# Altium project UcusKarti.PrjPcb (part 1 of 2)
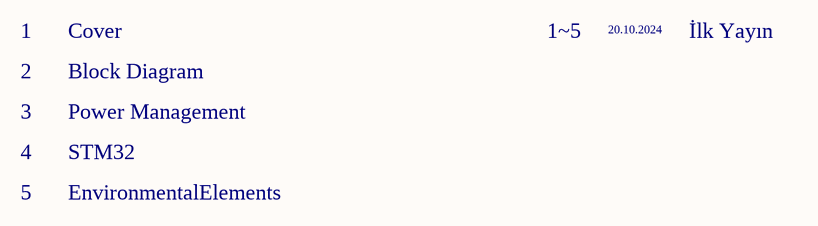
[diagram p0: Cover.SchDoc]
SheetSize: A3; ReleaseDate: 20.10.2024; ProjectDescription: Uçuş Kontrol Kartı; PreparedBy: Aslı Kurt
5 sheets, 52 parts. Net scope: global (net labels, ports and power ports of the same name join across sheets).
Board file: UcusKarti.PcbDoc
Sheets:
  Cover.SchDoc
  BlockDiagram.SchDoc
  PowerManagement.SchDoc
  STM32.SchDoc
  EnviromentalElements.SchDoc

## Sheet Cover.SchDoc
size A3; DocumentNumber: 1; SheetNumber: 1; SheetTotal: 5

### Notes on the sheet
- 1
- 2
- Cover
- Block Diagram
- 1~5
- 20.10.2024
- İlk Yayın
- 3
- Power Management
- 4
- 5
- STM32
- EnvironmentalElements
- İÇİNDEKİLER / CONTENTS
- REVİZYON / REVISION
- ÜRETİM NOTLARI / PRODUCTION NOTES
- Sayfa Nu.
- Page No
- Açıklama / Description
- Tarih
- Date
- Board Features
- Kart Özellikleri
- Üretim Çıktıları
- Gerber Files
- Ekler
- Attachments
- İLETİŞİM / CONTACT
- DOSYA ADI / FILE NAME
- TANIM / DESCRIPTION
- HAZIRLAYAN / PREPARED BY
- YAYIN TARİHİ / REL. DATE
- BOYUT / SIZE
- SAYFA / SHEET
- /

## Sheet BlockDiagram.SchDoc
size A3; DocumentNumber: 2; SheetNumber: 2; SheetTotal: 5; ProjectDescription: Uçuş Kontrol Kartı
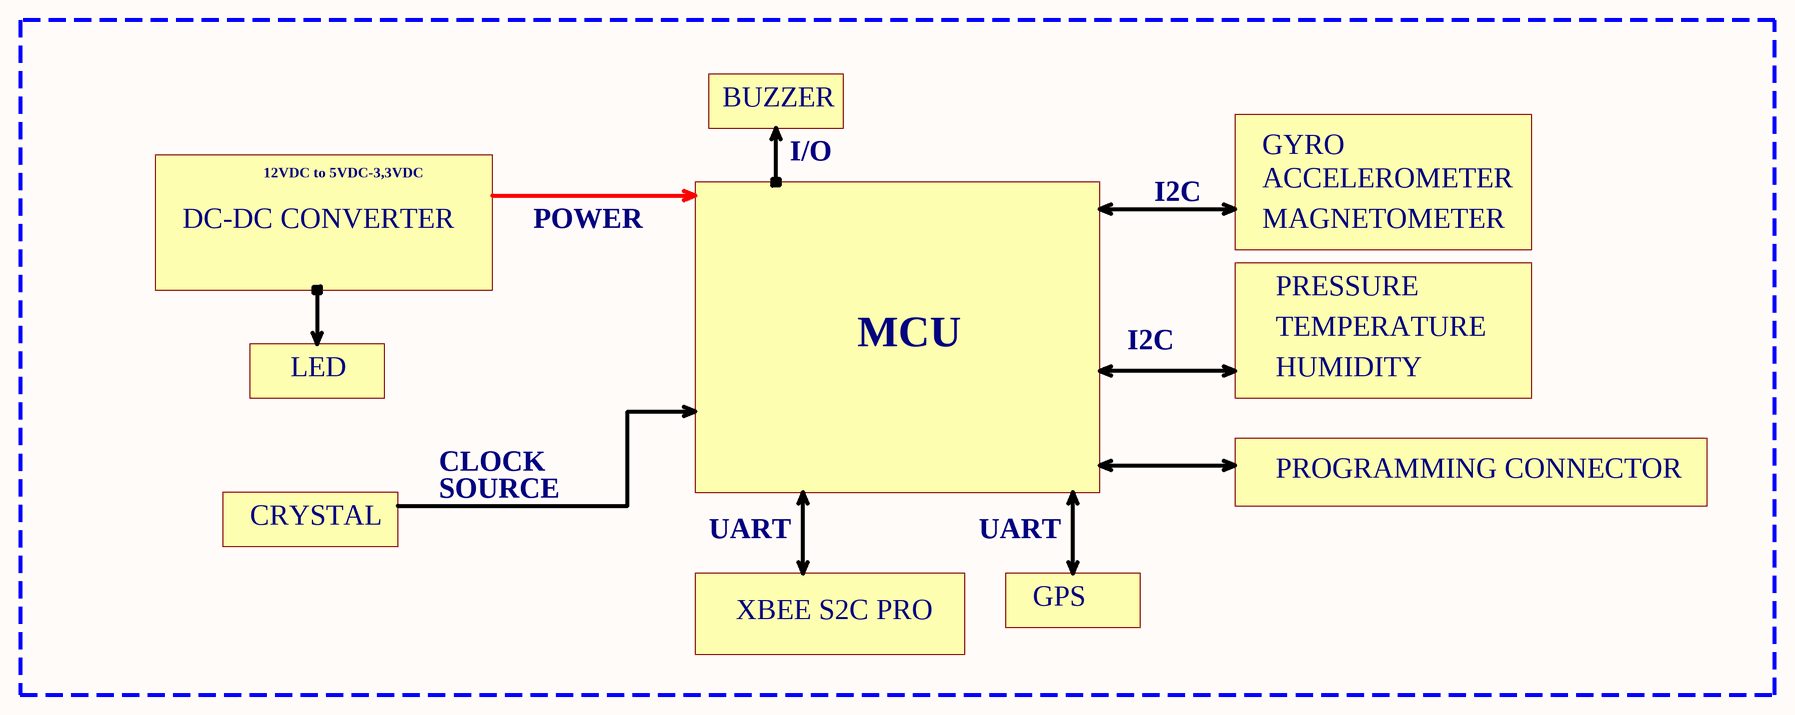
[diagram p1: BlockDiagram.SchDoc]

### Notes on the sheet
- BUZZER
- 12VDC to 5VDC-3,3VDC
- I/O
- GYRO
- DC-DC CONVERTER
- POWER
- I2C
- ACCELEROMETER
- MAGNETOMETER
- PRESSURE
- LED
- MCU
- TEMPERATURE
- HUMIDITY
- CLOCK
- SOURCE
- PROGRAMMING CONNECTOR
- CRYSTAL
- UART
- XBEE S2C PRO
- GPS
- DOSYA ADI / FILE NAME
- TANIM / DESCRIPTION
- HAZIRLAYAN / PREPARED BY
- YAYIN TARİHİ / REL. DATE
- BOYUT / SIZE
- SAYFA / SHEET
- /

## Sheet PowerManagement.SchDoc
size A3; DocumentNumber: 3; SheetNumber: 3; SheetTotal: 5; PreparedBy: Aslı Kurt
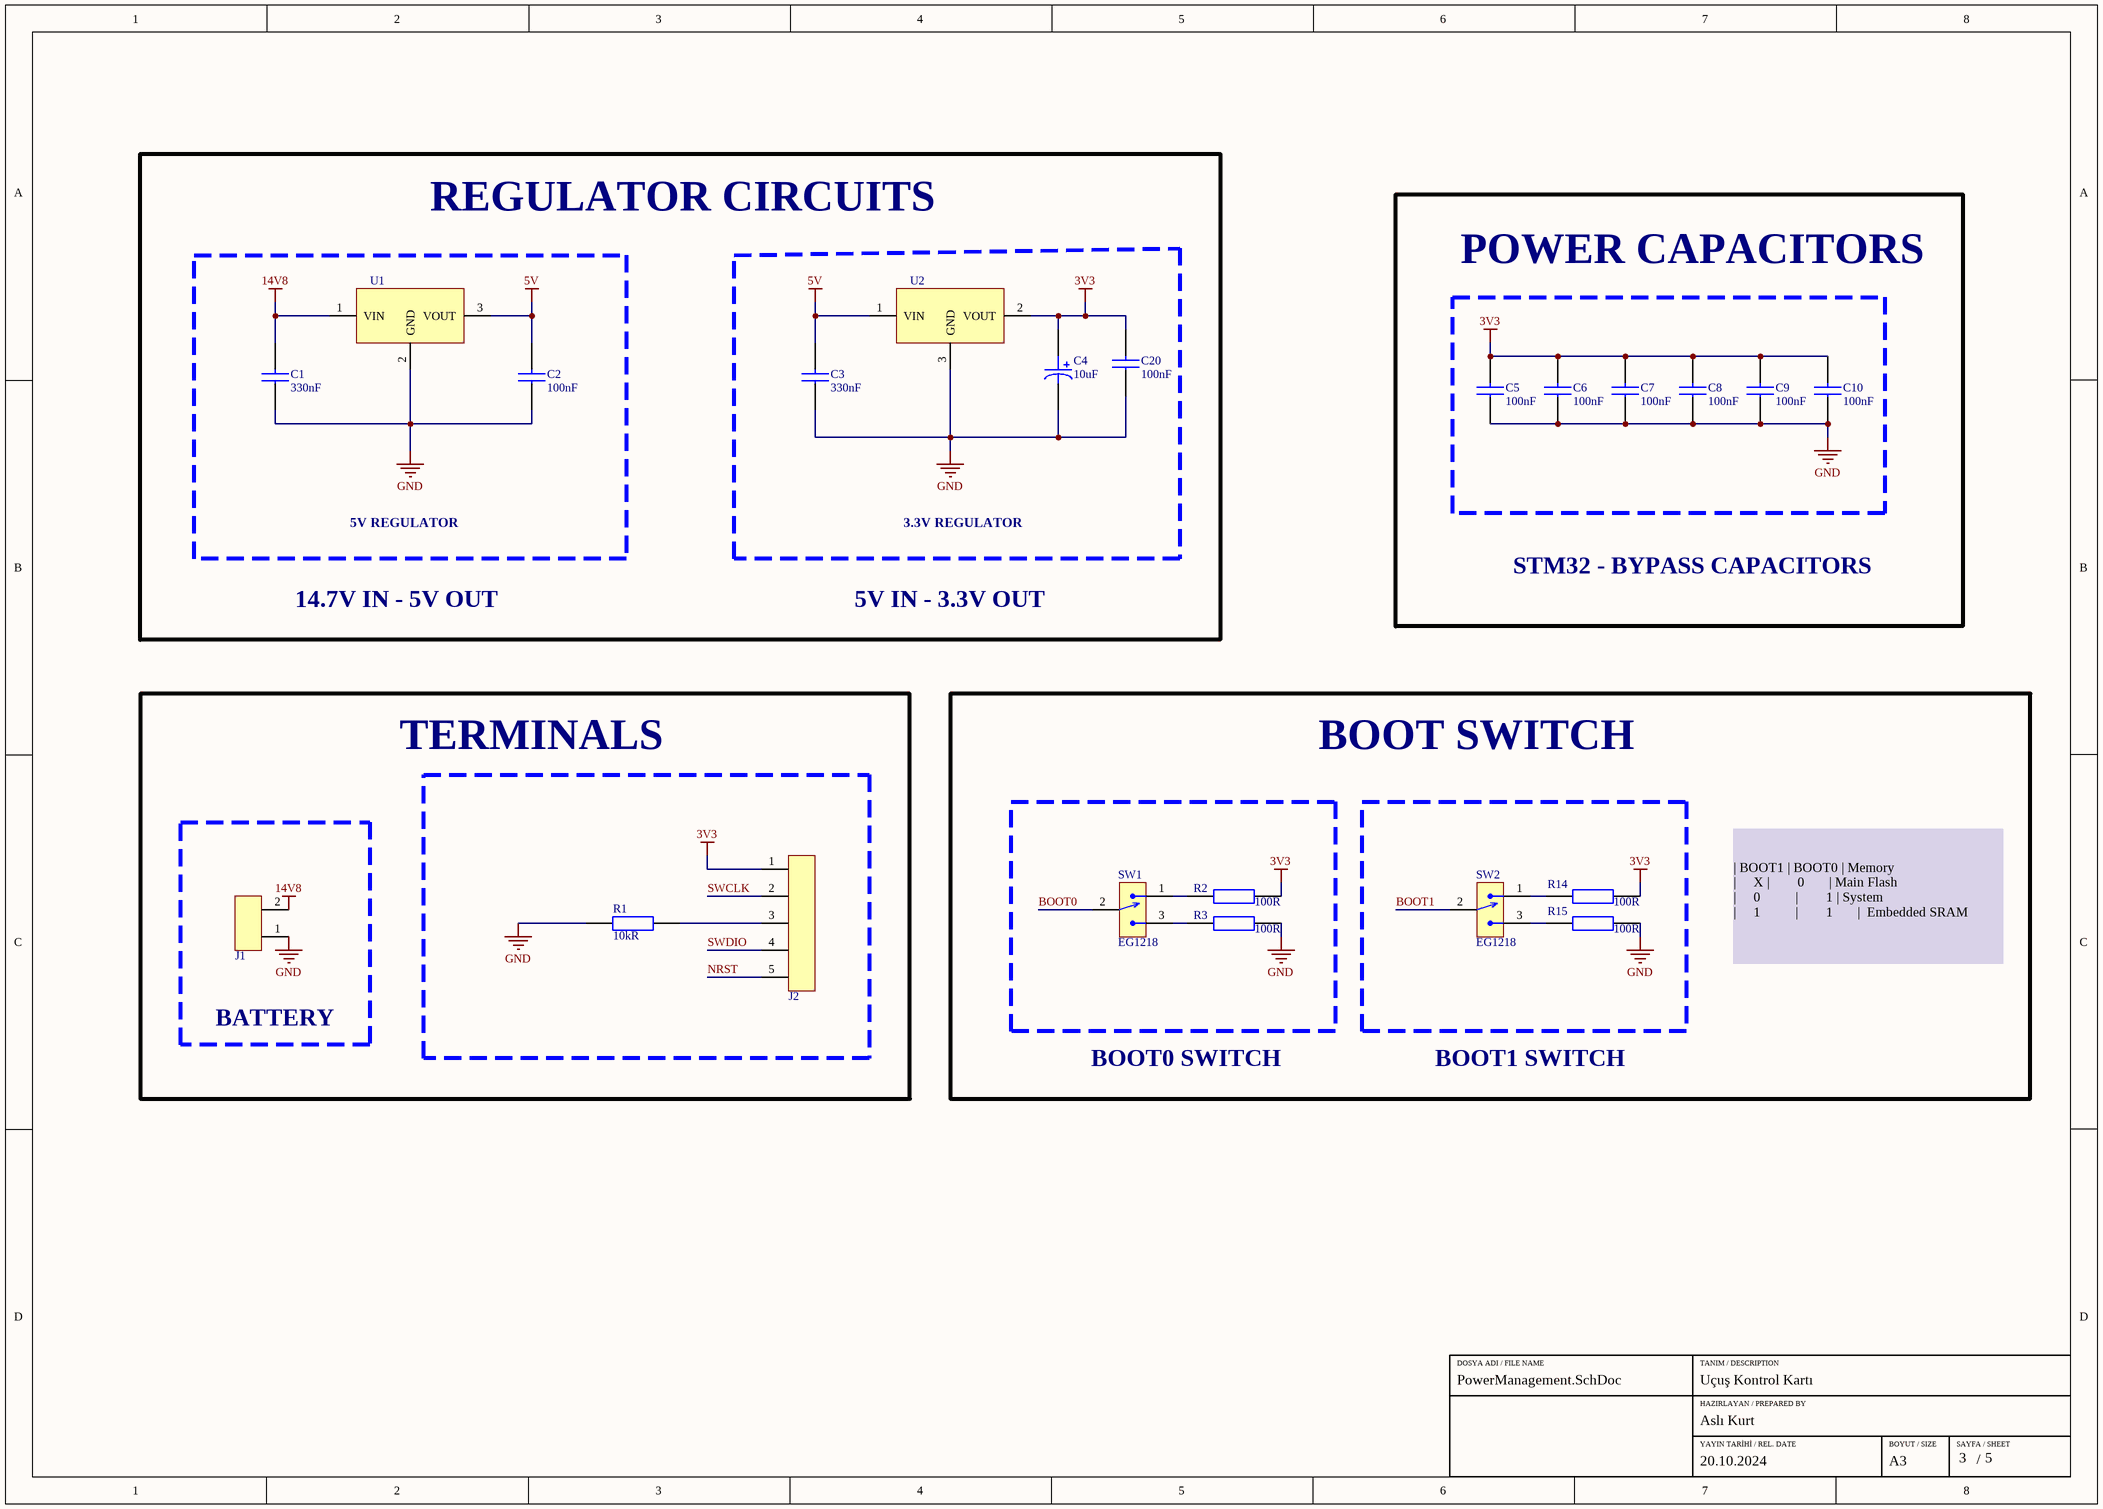
[diagram p2: PowerManagement.SchDoc]

### Parts
C1  Capacitance: 330nF  [CAP_0603]  (hidden comment: CGA3E3X7R1H334K080AB)
C2  Capacitance: 100nF  [CAP_0603]  (hidden comment: C0603C104K5RACTU)
C3  Capacitance: 330nF  [CAP_0603]  (hidden comment: CGA3E3X7R1H334K080AB)
C4  Capacitance: 10uF  [CAP_RADIAL_D5_P5.5_SMD]  (hidden comment: 865080642006)
C5  Capacitance: 100nF  [CAP_0603]  (hidden comment: C0603C104K5RACTU)
C6  Capacitance: 100nF  [CAP_0603]  (hidden comment: C0603C104K5RACTU)
C7  Capacitance: 100nF  [CAP_0603]  (hidden comment: C0603C104K5RACTU)
C8  Capacitance: 100nF  [CAP_0603]  (hidden comment: C0603C104K5RACTU)
C9  Capacitance: 100nF  [CAP_0603]  (hidden comment: C0603C104K5RACTU)
C10  Capacitance: 100nF  [CAP_0603]  (hidden comment: C0603C104K5RACTU)
C20  Capacitance: 100nF  [CAP_0603]  (hidden comment: C0603C104K5RACTU)
J1  282836-2  [TERMINAL]  (value not drawn)
J2  61300511121  [5x1 Male Header 2.54mm]  (value not drawn)
R1  Resistance: 10kR  [RES_0805]  (hidden comment: RC0805JR-0710KL)
R2  Resistance: 100R  [RES_0603]  (hidden comment: RC0603JR-07100RL)
R3  Resistance: 100R  [RES_0603]  (hidden comment: RC0603JR-07100RL)
R14  Resistance: 100R  [RES_0603]  (hidden comment: RC0603JR-07100RL)
R15  Resistance: 100R  [RES_0603]  (hidden comment: RC0603JR-07100RL)
SW1  EG1218  [SWITCHSLIDE_1POS_DIP]
SW2  EG1218  [SWITCHSLIDE_1POS_DIP]
U1  L7805CD2T-TR  [D2PAK-TO-263-3]  (value not drawn)
U2  LD29150DT33R  [DPAK-TO252]  (value not drawn)

### Blocks framed on the sheet
POWER CAPACITORS: C5-C10
5V REGULATOR: C1 C2 U1
3.3V REGULATOR: C3 C4 C20 U2
TERMINALS: J2 R1
BOOT SWITCH: R2 R3 R14 R15 SW1 SW2
BATTERY: J1

### Nets
3V3: C4.1 C5.2 C6.2 C7.2 C8.2 C9.2 C10.2 C20.2 J2.1 R2.2 R14.2 U2.2(VOUT)
5V: C2.2 C3.2 U1.3(VOUT) U2.1(VIN)
14V8: C1.2 J1.2 U1.1(VIN)
GND: C1.1 C2.1 C3.1 C4.2 C5.1 C6.1 C7.1 C8.1 C9.1 C10.1 C20.1 J1.1 R1.1 R3.2 R15.2 U1.2(GND) U2.3(GND)
BOOT0: SW1.2
BOOT1: SW2.2
NRST: J2.5
SWCLK: J2.2
SWDIO: J2.4
NetJ2_3: J2.3 R1.2
NetR2_1: R2.1 SW1.1
NetR3_1: R3.1 SW1.3
NetR14_1: R14.1 SW2.1
NetR15_1: R15.1 SW2.3

### Notes on the sheet
- REGULATOR CIRCUITS
- STM32 - BYPASS CAPACITORS
- 14.7V IN - 5V OUT
- 5V IN - 3.3V OUT
- | BOOT1	| BOOT0	| Memory
  |     X	|        0       | Main Flash
  |     0          |        1	| System
  |     1          |        1       |  Embedded SRAM
- BOOT0 SWITCH
- BOOT1 SWITCH
- DOSYA ADI / FILE NAME
- TANIM / DESCRIPTION
- HAZIRLAYAN / PREPARED BY
- YAYIN TARİHİ / REL. DATE
- BOYUT / SIZE
- SAYFA / SHEET
- /

### Library data of the parts
C1 C3 = CAP CER 330nF 0603: Multilayer Ceramic Capacitor, 0.33 uF, 50 V, ± 10%, X7R, 0603 [1608 Metric]; Manufacturer: TDK; DesignedBy: Aslı Kurt; Material: 4241ConductorMaterial; Voltage Rating: 50V; Supplier 1: Rs; Manufacturer Part Number: CGA3E3X7R1H334K080AB; RoHS: Yes; Category: Ceramic Capacitors; Stock 1: 1350; Pricing 1: 50=0,082, 250=0,066, 500=0,058, 1000=0,049 (GBP); Mount: Surface Mount; Case/Package: 0603; Case Code (Metric): 1608; Case Code (Imperial): 0603; Weight: 7.1E-05oz; Min Operating Temperature: -55°C; Max Operating Temperature: 125°C; Packaging: Tape and Reel; Tolerance: 10%; Dielectric: X7R; Termination: SMD/SMT; Voltage Rating (DC): 50V; Package Quantity: 4000; Series: CGA; Length: 0.063inch; Width: 0.031inch; Height: 0.8mm; Thickness: 0.035inch; Ratings: AEC-Q200; RoHS Compliant: Yes; ComponentLink1URL: http://www.mouser.com/ds/2/400/lcc_automotive_general_en-843974.pdf?src-supplier=Mouser; ComponentLink1Description: http://www.mouser.com/ds/2/400/lcc_automotive_general_en-843974.pdf?src-supplier=Mouser; ComponentLink2URL: https://datasheet.octopart.com/CGA3E3X7R1H334K080AB-TDK-datasheet-43366117.pdf?src-supplier=Future+Electronics; ComponentLink2Description: https://datasheet.octopart.com/CGA3E3X7R1H334K080AB-TDK-datasheet-43366117.pdf?src-supplier=Future+Electronics; ComponentLink3URL: https://product.tdk.com/info/en/documents/chara_sheet/CGA3E3X7R1H334K080AB.pdf?src-supplier=Digikey; ComponentLink3Description: https://product.tdk.com/info/en/documents/chara_sheet/CGA3E3X7R1H334K080AB.pdf?src-supplier=Digikey; ComponentLink4URL: https://product.tdk.com/info/en/catalog/datasheets/mlcc_automotive_general_en.pdf?src-supplier=Digikey; ComponentLink4Description: https://product.tdk.com/info/en/catalog/datasheets/mlcc_automotive_general_en.pdf?src-supplier=Digikey; ComponentLink5URL: http://product.tdk.com/capacitor/mlcc/class/print_detail_pdf.php?lang=en&part_no=CGA3E3X7R1H334K080AB&src-supplier=Avnet; ComponentLink5Description: http://product.tdk.com/capacitor/mlcc/class/print_detail_pdf.php?lang=en&part_no=CGA3E3X7R1H334K080AB&src-supplier=Avnet; ComponentLink6URL: https://datasheet.octopart.com/CGA3E3X7R1H334K080AB-TDK-datasheet-165583812.pdf?src-supplier=TME; ComponentLink6Description: https://datasheet.octopart.com/CGA3E3X7R1H334K080AB-TDK-datasheet-165583812.pdf?src-supplier=TME; Supplier 2: Avnet; Stock 2: 26394; Pricing 2: 1=0,231, 10=0,105, 25=0,093, 50=0,08, 100=0,068 (USD); Supplier 3: Farnell; Stock 3: 76750; Pricing 3: 10=0,156, 100=0,0848, 500=0,0677, 1000=0,0505, 2000=0,0453, 4000=0,04, 20000=0,0371, 40000=0,0362 (EUR); Supplier 4: Mouser; Stock 4: 154875; Pricing 4: 1=0,23, 10=0,098, 50=0,098, 100=0,063, 1000=0,053, 10000=0,032 (USD); Supplier 5: Digikey; Stock 5: 1242048; Pricing 5: 1=0,24, 10=0,139, 50=0,0982, 100=0,0858, 500=0,06458, 1000=0,05797 (USD); Supplier Part Number 1: 2427476; Supplier Part Number 2: 71AH2809; Supplier Part Number 3: 3416368; Supplier Part Number 4: 810-CGA3E3X7R1H334KB; Supplier Part Number 5: 445-174426-1-ND
C2 C5-C10 C20 = CAP CER 100nF 0603: CAP CER 100nF %10 0603 SMD; Manufacturer: KEMET; DesignedBy: Aslı Kurt; Dielectric Material: Ceramic; Voltage Rating (DC): 50V; Tolerance: 10%; Dielectric: X7R; Dissipation Factor: 2.5%; Supplier 1: Digi-Key; Manufacturer Part Number: C0603C104K5RACTU; RoHS: Yes; Category: Ceramic Capacitors; Stock 1: 1666186; Pricing 1: 1=0,12000, 10=0,08500, 50=0,04620, 100=0,03770, 500=0,02696, 1000=0,02118 (USD); Mount: Surface Mount; Case/Package: 0603; Number of Pins: 2; Case Code (Metric): 1608; Case Code (Imperial): 0603; Contact Plating: Tin,Matte; Min Operating Temperature: -55°C; Max Operating Temperature: 125°C; Packaging: Tape and Reel; Package Quantity: 1; Termination: SMD/SMT; Voltage: 50V; Voltage Rating: 50V; Series: SMD Comm X7R; Length: 0.063inch; Width: 0.031inch; Height: 0.8mm; Thickness: 0.034inch; Lead Pitch: 0.7mm; Depth: 0.8mm; Radiation Hardening: No; RoHS Compliant: Yes; REACH SVHC: No SVHC; ComponentLink1URL: https://datasheet.ciiva.com/7823/kem-c1002-x7r-smd-7823591.pdf?src-supplier=Element14; ComponentLink1Description: https://datasheet.ciiva.com/7823/kem-c1002-x7r-smd-7823591.pdf?src-supplier=Element14; ComponentLink2URL: https://datasheet.ciiva.com/14602/70095383-14602583.pdf?src-supplier=Allied+Electronics; ComponentLink2Description: https://datasheet.ciiva.com/14602/70095383-14602583.pdf?src-supplier=Allied+Electronics; ComponentLink3URL: https://datasheet.ciiva.com/5999/kem-c1002-x7r-smd-5999400.pdf?src-supplier=Farnell; ComponentLink3Description: https://datasheet.ciiva.com/5999/kem-c1002-x7r-smd-5999400.pdf?src-supplier=Farnell; ComponentLink4URL: https://datasheet.ciiva.com/7823/kem-c1002-x7r-smd-7823592.pdf?src-supplier=Element14; ComponentLink4Description: https://datasheet.ciiva.com/7823/kem-c1002-x7r-smd-7823592.pdf?src-supplier=Element14; ComponentLink5URL: https://datasheet.ciiva.com/28645/1851736-28645640.pdf?src-supplier=Element14; ComponentLink5Description: https://datasheet.ciiva.com/28645/1851736-28645640.pdf?src-supplier=Element14; ComponentLink6URL: https://datasheet.ciiva.com/14585/70095383-14585209.pdf?src-supplier=Allied+Electronics; ComponentLink6Description: https://datasheet.ciiva.com/14585/70095383-14585209.pdf?src-supplier=Allied+Electronics; Supplier Part Number 1: 399-5089-1-ND
C4 = CAP ALU ELEC 10uF  50V: CAP ALUM 10UF 20% 50V SMD; Manufacturer: Wurth Electronics; Ripple Current: 95mA; Impedance: 2.8R; ESR (Equivalent Series Resistance): 1.63932R; Insulation Resistance: 10MR; Leakage Current: 5uA; DesignedBy: Aslı Kurt; Supplier 1: Rs; Manufacturer Part Number: 865080642006; RoHS: Yes; Category: Aluminum Electrolytic Capacitors; Stock 1: 250; Pricing 1: 25=0,16 (GBP); Mount: Surface Mount; Case/Package: Radial; Min Operating Temperature: -55°C; Max Operating Temperature: 105°C; Package Quantity: 1; Packaging: Cut Tape; Voltage Rating: 50V; Ripple Current (AC): 95mA; Tolerance: 20%; Voltage Rating (DC): 50V; Series: WCAP-ASLI; Diameter: 5mm; Length: 5.5mm; Width: 5.3mm; Height: 5.5mm; Height - Seated (Max): 0.217inch; RoHS Compliant: Yes; Reach SVHC Compliant: Unknown; ComponentLink1URL: http://www.farnell.com/datasheets/1880176.pdf?src-supplier=Farnell; ComponentLink1Description: http://www.farnell.com/datasheets/1880176.pdf?src-supplier=Farnell; ComponentLink2URL: http://www.farnell.com/datasheets/1880176.pdf?src-supplier=Element14; ComponentLink2Description: http://www.farnell.com/datasheets/1880176.pdf?src-supplier=Element14; ComponentLink3URL: http://www.farnell.com/datasheets/1880176.pdf?src-supplier=Newark; ComponentLink3Description: http://www.farnell.com/datasheets/1880176.pdf?src-supplier=Newark; ComponentLink4URL: http://katalog.we-online.de/pbs/datasheet/865080642006.pdf?src-supplier=Digikey; ComponentLink4Description: http://katalog.we-online.de/pbs/datasheet/865080642006.pdf?src-supplier=Digikey; ComponentLink5URL: https://katalog.we-online.de/pbs/datasheet/865080642006.pdf?src-supplier=Digikey; ComponentLink5Description: https://katalog.we-online.de/pbs/datasheet/865080642006.pdf?src-supplier=Digikey; Supplier 2: Farnell; Stock 2: 875; Pricing 2: 1=0,27, 50=0,165, 100=0,154, 250=0,128, 500=0,112, 1000=0,108, 5000=0,107, 10000=0,105 (EUR); Supplier 3: Mouser; Stock 3: 13568; Pricing 3: 1=0,2, 10=0,2, 50=0,174, 100=0,151, 1000=0,112, 10000=0,112 (USD); Supplier 4: Digikey; Stock 4: 72984; Pricing 4: 1=0,2, 50=0,174, 100=0,151, 250=0,134, 500=0,118 (USD); Supplier Part Number 4: 732-8451-1-ND; Supplier Part Number 3: 710-865080642006; Supplier Part Number 2: 2466333; Supplier Part Number 1: 8391862
J1 = 2x1 TERMINAL 5mm: Connector, Terminal Block; Wire Receptacle; 2 Pos.; 16-30 AWG; 0.197 in. CL; Sid; Manufacturer: TE Connectivity; DesignedBy: Aslı Kurt; Plating: Brass; Number of Positions: 2; Number of Levels: 1; Current: 13.5A; Voltage: 300V; Interlock: Yes (With); Screw Flange: No (Without); Connector System: 5937ConnectorSystem; Voltage Rating (DC): 250V; Pitch: 5mm; Wire Gauge (Max): 30AWG; Thread Size: M3; Tail Length: 3.5mm; Approvals: UL; Supplier 1: Digikey; Manufacturer Part Number: 282836-2; RoHS: Yes; Category: Terminal Blocks; Stock 1: 33835; Pricing 1: 1=0,6, 10=0,578, 25=0,576, 50=0,5566, 100=0,4666, 300=0,43743, 600=0,41315, 1200=0,36211, 5100=0,31593 (USD); Mount: Through Hole; Color: Green; Contact Material: Brass; Housing Color: Green; Contact Plating: Tin; Housing Material: Polyamide; Insulation Material: Nylon; Min Operating Temperature: -40°C; Max Operating Temperature: 105°C; Number of Rows: 1; Termination: Solder; Series: Buchanan; Packaging: Tray; Package Quantity: 300; Number of Positions Per Level: 2; Number of Contacts: 2; Orientation: Straight; Current Rating: 13.5A; Number of Circuits: 2; Screwless Terminal Block: No (Without); Side Stackable: Yes (With); Operating Supply Voltage: 300V; Voltage Rating: 300V; Max Voltage Rating (AC): 300V; Number of Poles: 2; Max Supply Voltage (AC): 300V; Connector Type: Receptacle; Closed End: No (Without); Max Current Rating: 13.5A; Length: 10.6mm; Width: 10mm; Wire Gauge (Min): 30AWG; Wire/Cable Gauge: 30AWG; Depth: 8.2mm; Radiation Hardening: No; Flammability Rating: UL94 V-0; RoHS Compliant: Yes; ELV: Compliant; Lead Free: Lead Free; Reach SVHC Compliant: Unknown; ComponentLink1URL: https://datasheet.ciiva.com/7628/1731782-7628513.pdf?src-supplier=Element14; ComponentLink1Description: https://datasheet.ciiva.com/7628/1731782-7628513.pdf?src-supplier=Element14; ComponentLink2URL: https://datasheet.ciiva.com/16393/282836-2-16393382.pdf?src-supplier=Future+Electronics; ComponentLink2Description: https://datasheet.ciiva.com/16393/282836-2-16393382.pdf?src-supplier=Future+Electronics; ComponentLink3URL: https://datasheet.ciiva.com/15169/getdatasheetpartid-155855-15169553.pdf?src-supplier=Verical; ComponentLink3Description: https://datasheet.ciiva.com/15169/getdatasheetpartid-155855-15169553.pdf?src-supplier=Verical; ComponentLink4URL: https://datasheet.ciiva.com/11757/0900766b8002dc8a-11757385.pdf?src-supplier=Rs; ComponentLink4Description: https://datasheet.ciiva.com/11757/0900766b8002dc8a-11757385.pdf?src-supplier=Rs; ComponentLink5URL: https://datasheet.ciiva.com/823/eng-cd-282836-h10-823437.pdf?src-supplier=Digikey; ComponentLink5Description: https://datasheet.ciiva.com/823/eng-cd-282836-h10-823437.pdf?src-supplier=Digikey; ComponentLink6URL: https://datasheet.ciiva.com/3141/eng-cs-1308389-eurostyle-terminal-blocks-0607-3141118.pdf?src-supplier=Avnet; ComponentLink6Description: https://datasheet.ciiva.com/3141/eng-cs-1308389-eurostyle-terminal-blocks-0607-3141118.pdf?src-supplier=Avnet; ComponentLink7URL: https://datasheet.ciiva.com/30261/eng-cs-1308389-eurostyle-terminal-blocks-0607-30261813.pdf?src-supplier=Onlinecomponents.com; ComponentLink7Description: https://datasheet.ciiva.com/30261/eng-cs-1308389-eurostyle-terminal-blocks-0607-30261813.pdf?src-supplier=Onlinecomponents.com; Supplier Part Number 1: A98076-ND
J2 = 5x1 Male Header 2.54mm: DesignedBy: Aslı Kurt
R1 = RES 10K OHM 0805: RES 10K OHM 5% 1/8W 0805; Manufacturer: Yageo; DesignedBy: Aslı Kurt; Power Rating: 125mW; Temperature Coefficient: 100ppm/°C; Voltage Rating: 150V; Supplier 1: Digikey; Manufacturer Part Number: RC0805JR-0710KL; RoHS: Yes; Category: Chip SMD Resistors; Stock 1: 444162; Pricing 1: 1=0,1, 10=0,023, 50=0,0144, 100=0,012, 500=0,00818, 1000=0,00706 (USD); Case/Package: 0805; Contact Plating: Tin,Matte; Case Code (Imperial): 0805; Case Code (Metric): 2012; Size Code: 0805; Min Operating Temperature: -55°C; Max Operating Temperature: 155°C; Resistor Type: Thick Film; Tolerance: 5%; Packaging: Tape and Reel; Termination: SMD/SMT; Features: Moisture Resistant; Series: RC; Max Power Dissipation: 125mW; Number of Terminations: 2; Resistance Tolerance: 5%; Construction: Rectangular; Length: 2mm; Width: 1.25mm; Height: 0.5mm; Depth: 1.25mm; Radiation Hardening: No; RoHS Compliant: Yes; Military Standard: Not; Reach SVHC Compliant: Unknown; Lead Free: 5697LeadFree; ComponentLink1URL: https://datasheet.ciiva.com/7983/444164-7983765.pdf?src-supplier=Element14; ComponentLink1Description: https://datasheet.ciiva.com/7983/444164-7983765.pdf?src-supplier=Element14; ComponentLink2URL: https://datasheet.ciiva.com/7941/444164-7941870.pdf?src-supplier=Element14; ComponentLink2Description: https://datasheet.ciiva.com/7941/444164-7941870.pdf?src-supplier=Element14; ComponentLink3URL: https://datasheet.ciiva.com/7941/444164-7941871.pdf?src-supplier=Element14; ComponentLink3Description: https://datasheet.ciiva.com/7941/444164-7941871.pdf?src-supplier=Element14; Supplier Part Number 1: 311-10KARCT-ND
R2 R3 R14 R15 = RES 100 OHM 0603: RES 100 %5 OHM 0603 SMD; Manufacturer: Yageo; DesignedBy: Aslı Kurt; Tolerance: 5%; Temperature Coefficient: 100ppm/°C; Voltage Rating (DC): 50V; Power Rating: 100mW; Supplier 1: Digi-Key; Manufacturer Part Number: RC0603JR-07100RL; RoHS: Yes; Category: Chip SMD Resistors; Stock 1: 4334796; Pricing 1: 1=0,10000, 10=0,01900, 100=0,00770, 1000=0,00344, 2500=0,00298 (USD); Case/Package: 0603; Number of Pins: 2; Contact Plating: Tin,Matte; Case Code (Imperial): 0603; Case Code (Metric): 1608; Size Code: 0603; Min Operating Temperature: -55°C; Max Operating Temperature: 155°C; Resistor Type: Thick Film; Packaging: Tape and Reel; Voltage Rating: 50V; Termination: SMD/SMT; Features: Moisture Resistant; Series: RC; Max Power Dissipation: 100mW; Number of Terminations: 2; Construction: Rectangular; Resistance Tolerance: 5%; Length: 1.6mm; Width: 0.8mm; Depth: 0.8mm; Radiation Hardening: No; REACH SVHC: Unknown; Lead Free: Lead Free; Military Standard: Not; RoHS Compliant: Yes; ComponentLink1URL: https://datasheet.ciiva.com/15189/getdatasheetpartid-325207-15189846.pdf?src-supplier=Verical; ComponentLink1Description: https://datasheet.ciiva.com/15189/getdatasheetpartid-325207-15189846.pdf?src-supplier=Verical; ComponentLink2URL: https://datasheet.ciiva.com/8883/pyu-rc0603-51-rohs-l-4-8883047.pdf?src-supplier=Avnet; ComponentLink2Description: https://datasheet.ciiva.com/8883/pyu-rc0603-51-rohs-l-4-8883047.pdf?src-supplier=Avnet; ComponentLink3URL: https://datasheet.ciiva.com/7746/443971-7746425.pdf?src-supplier=Element14; ComponentLink3Description: https://datasheet.ciiva.com/7746/443971-7746425.pdf?src-supplier=Element14; ComponentLink4URL: https://datasheet.ciiva.com/7746/443971-7746426.pdf?src-supplier=Element14; ComponentLink4Description: https://datasheet.ciiva.com/7746/443971-7746426.pdf?src-supplier=Element14; Supplier Part Number 1: 311-100GRCT-ND
SW1 SW2 = EG1218: Slide Switch, SPDT, ON-ON, 200 mA, 30V DC, TH, PC Pin, EG Series | E-Switch EG1218; Contact Current Rating: 200mA; Operating Force: 250gf; Illumination Type: Non-Illuminated; Electrical Life: 10000Cycles; Number of Positions: 2; Switch Travel: 2.5mm; Insulation Resistance: 100R; Contact Resistance: 20mR; Actuator Type: Standard; Dropout Voltage: 300mV; Max Output Current: 150mA; Min Input Voltage: 4.3V; Nominal Output Voltage: 3.3V; Power Rating: 250mW; Actuator Length: 2mm; DesignedBy: Aslı Kurt; Supplier 1: Future Electronics; Manufacturer: E-Switch; Manufacturer Part Number: EG1218; RoHS: Yes; Category: Slide Switches; Stock 1: 30199; Pricing 1: 1=0,43, 100=0,41, 200=0,4, 300=0,435, 500=0,385, 1000=0,42, 1250=0,36, 3000=0,39 (USD); Mount: Through Hole; Case/Package: 947Case; Number of Pins: 3; Contact Material: Copper Alloy,Copper,Silver; Contact Plating: Silver; Min Operating Temperature: -20°C; Max Operating Temperature: 70°C; Throw Configuration: SPDT; Voltage Rating (AC): 30V; Voltage Rating (DC): 30V; Packaging: Bulk; Termination: PC Pin; Orientation: Straight; Switch Function: On-On; Voltage Rating: 30V; Series: EG; Output Current: 150mA; Output Voltage: 3.3V; Radiation Hardening: 5898YesNo; Reach SVHC Compliant: No; Lead Free: Lead Free; RoHS Compliant: Yes; ComponentLink1URL: https://datasheet.ciiva.com/1699/p040040c-1699451.pdf?src-supplier=Newark; ComponentLink1Description: https://datasheet.ciiva.com/1699/p040040c-1699451.pdf?src-supplier=Newark; Supplier 2: Future Electronics; Stock 2: 8336; Pricing 2: 1=0,43, 100=0,41, 200=0,4, 500=0,385, 1250=0,36 (USD); Supplier 3: Farnell; Stock 3: 1815; Pricing 3: 10=0,683, 50=0,657, 100=0,571, 250=0,52 (EUR); Supplier 4: Digikey; Stock 4: 31000; Pricing 4: 1=0,88, 10=0,72, 25=0,6628, 100=0,5837, 250=0,53608, 500=0,5023, 1000=0,47033, 3000=0,4231, 5000=0,40248 (USD); Supplier 5: Mouser; Stock 5: 14215; Pricing 5: 1=0,75, 10=0,66, 50=0,66, 100=0,554, 1000=0,458, 10000=0,402 (USD); Supplier Part Number 1: 9403163; Supplier Part Number 5: 612-EG1218; Supplier Part Number 4: EG1903-ND; Supplier Part Number 3: 2787232; Supplier Part Number 2: 7125310
U1 = L7805CD2T-TR: Standard Regulator Pos 5V 1.5A 3-Pin(2+Tab) D2PAK T/R / IC REG LDO 5V 1.5A D2PAK; Manufacturer: STMicroelectronics; Uretici Kodu: L7805CDT-TR; Kılıf: DPAK; -Sicaklik: -40; +Sicaklik: +125; Max Input Voltage: 35V; Number of Outputs: 1; Polarity: Positive; Quiescent Current: 8mA; Output Type: Fixed; Min Input Voltage: 10V; Dropout Voltage: 2V; Min Output Voltage: 4.8V; Power Supply Rejection Ratio (PSRR): 62dB; Nominal Supply Current: 4.3mA; Number of Channels: 1NUMBER; DesignedBy: Aslı Kurt; Cins: IC; Supplier 1: Future Electronics; RoHS: Yes; Category: Voltage Regulators - Linear; Stock 1: 202000; Pricing 1: 1000=0,31, 3000=0,3, 5000=0,295, 10000=0,29, 20000=0,28 (USD); Mount: Surface Mount; Case/Package: TO-263; Number of Pins: 3; Weight: 7.1E-05oz; Min Operating Temperature: 0°C; Max Operating Temperature: 125°C; Output Voltage: 5V; Output Current: 1.5A; Packaging: Tape and Reel; Max Output Current: 1.5A; Package Quantity: 1000; Nominal Output Voltage: 5V; Number of Regulators: 1; Series: -; Length: 10.4mm; Width: 9.35mm; Height: 4.6mm; RoHS Compliant: Yes; Reach SVHC Compliant: No; Lead Free: Lead Free; ComponentLink1URL: https://datasheet.ciiva.com/36526/1991686-36526238.pdf?src-supplier=Jameco; ComponentLink1Description: https://datasheet.ciiva.com/36526/1991686-36526238.pdf?src-supplier=Jameco; ComponentLink2URL: https://datasheet.ciiva.com/1511/1805459-1511910.pdf?src-supplier=Element14; ComponentLink2Description: https://datasheet.ciiva.com/1511/1805459-1511910.pdf?src-supplier=Element14; ComponentLink3URL: https://datasheet.ciiva.com/2053/cd00000444-2053730.pdf?src-supplier=Digikey; ComponentLink3Description: https://datasheet.ciiva.com/2053/cd00000444-2053730.pdf?src-supplier=Digikey; ComponentLink4URL: https://datasheet.ciiva.com/4881/cd00000444-4881992.pdf?src-supplier=Mouser; ComponentLink4Description: https://datasheet.ciiva.com/4881/cd00000444-4881992.pdf?src-supplier=Mouser; ComponentLink5URL: https://datasheet.ciiva.com/16385/cd00000444-16385288.pdf?src-supplier=Future+Electronics; ComponentLink5Description: https://datasheet.ciiva.com/16385/cd00000444-16385288.pdf?src-supplier=Future+Electronics; ComponentLink6URL: https://datasheet.ciiva.com/46618/1805459-46618855.pdf?src-supplier=Newark; ComponentLink6Description: https://datasheet.ciiva.com/46618/1805459-46618855.pdf?src-supplier=Newark; ComponentLink7URL: https://datasheet.ciiva.com/22710/1805459-22710937.pdf?src-supplier=Element14; ComponentLink7Description: https://datasheet.ciiva.com/22710/1805459-22710937.pdf?src-supplier=Element14; ComponentLink8URL: https://datasheet.ciiva.com/7647/1805459-7647813.pdf?src-supplier=Element14; ComponentLink8Description: https://datasheet.ciiva.com/7647/1805459-7647813.pdf?src-supplier=Element14; ComponentLink9URL: https://datasheet.ciiva.com/2053/cd00000444-2053731.pdf?src-supplier=Digikey; ComponentLink9Description: https://datasheet.ciiva.com/2053/cd00000444-2053731.pdf?src-supplier=Digikey; ComponentLink10URL: https://datasheet.ciiva.com/2053/cd00000444-2053732.pdf?src-supplier=Digikey; ComponentLink10Description: https://datasheet.ciiva.com/2053/cd00000444-2053732.pdf?src-supplier=Digikey; Supplier 2: Mouser; Stock 2: 13102; Pricing 2: 1=0,83, 10=0,685, 50=0,685, 100=0,52, 1000=0,348, 10000=0,287 (USD); Supplier 3: Rs; Stock 3: 6020; Pricing 3: 50=0,516, 100=0,49, 250=0,463, 500=0,441 (GBP); Supplier 4: Avnet; Stock 4: 704; Pricing 4: 1=0,886, 10=0,741, 25=0,686, 50=0,631, 100=0,576 (USD); Supplier 5: Farnell; Stock 5: 8724; Pricing 5: 1=0,886, 10=0,702, 50=0,486, 200=0,45, 500=0,413 (EUR); Supplier 6: Digikey; Stock 6: 13327; Pricing 6: 1=0,83, 10=0,729, 25=0,6848, 100=0,5588, 250=0,51908, 500=0,44176 (USD); Supplier Part Number 6: 497-1171-1-ND; Supplier Part Number 5: 1366576; Supplier Part Number 4: 95M4314; Supplier Part Number 3: 7140657P; Supplier Part Number 2: 511-L7805CD2T-TR; Supplier Part Number 1: 4623278; Manufacturer Part Number: L7805CD2T-TR
U2 = LD29150DT33R: LD29150 Series 3.3 V 1.5 A Fixed Output SMT LDO Voltage Regulator - TO-252; Manufacturer: STMicroelectronics; Cins: IC; Uretici Kodu: LD1086DT33TR; Kılıf: DPAK; -Sicaklik: -40; +Sicaklik: +125; DesignedBy: Aslı Kurt; Supplier 1: Future Electronics; RoHS: No; Category: Voltage Regulators - Linear; Stock 1: 10000; Pricing 1: 2500=0,715, 5000=0,7, 7500=0,69, 10000=0,685, 12500=0,665 (USD); ComponentLink1URL: https://datasheet.ciiva.com/1569/1788499-1569956.pdf?src-supplier=Farnell; ComponentLink1Description: https://datasheet.ciiva.com/1569/1788499-1569956.pdf?src-supplier=Farnell; ComponentLink2URL: https://datasheet.ciiva.com/41440/001184976-da-01-en-ic-reg-ldo-3-3-ld29150dt33r-to-252-3-stm-41440118.pdf?src-supplier=Conrad; ComponentLink2Description: https://datasheet.ciiva.com/41440/001184976-da-01-en-ic-reg-ldo-3-3-ld29150dt33r-to-252-3-stm-41440118.pdf?src-supplier=Conrad; ComponentLink3URL: https://datasheet.ciiva.com/2044/cd00003403-2044031.pdf?src-supplier=Digikey; ComponentLink3Description: https://datasheet.ciiva.com/2044/cd00003403-2044031.pdf?src-supplier=Digikey; ComponentLink4URL: https://datasheet.ciiva.com/2044/cd00003403-2044032.pdf?src-supplier=Digikey; ComponentLink4Description: https://datasheet.ciiva.com/2044/cd00003403-2044032.pdf?src-supplier=Digikey; ComponentLink5URL: https://datasheet.ciiva.com/2044/cd00003403-2044033.pdf?src-supplier=Digikey; ComponentLink5Description: https://datasheet.ciiva.com/2044/cd00003403-2044033.pdf?src-supplier=Digikey; ComponentLink6URL: https://datasheet.ciiva.com/22694/1904189-22694855.pdf?src-supplier=Element14; ComponentLink6Description: https://datasheet.ciiva.com/22694/1904189-22694855.pdf?src-supplier=Element14; Supplier 2: Mouser; Stock 2: 10050; Pricing 2: 1=1,61, 10=1,37, 50=1,37, 100=1,1, 1000=0,789, 10000=0,68 (USD); Supplier 3: Rs; Stock 3: 170; Pricing 3: 10=1,218, 100=0,826, 500=0,782, 1000=0,61 (GBP); Supplier 4: Digikey; Stock 4: 12678; Pricing 4: 1=1,61, 10=1,443, 25=1,3608, 100=1,1596, 250=1,0888, 500=0,95268, 1000=0,78937 (USD); Supplier Part Number 2: 511-LD29150DT33R; Supplier Part Number 1: 6030624; Supplier Part Number 3: 6868704P; Supplier Part Number 4: 497-1496-1-ND; Manufacturer Part Number: LD29150DT33R